# Altium schematic sheet PLC.SchDoc
size A4; SheetNumber: 2; SheetTotal: 2
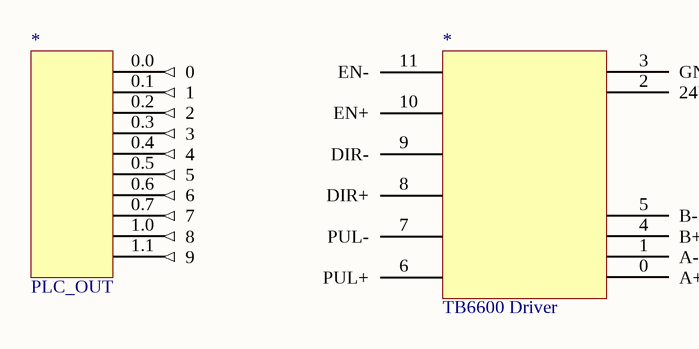
[diagram p0: PLC.SchDoc]

## Parts
(Parts that share a designator on the sheet are numbered #1, #2 ... from top to bottom, then left to right.)
*#1  TB6600 Driver
*#2  PLC_OUT

## Nets

Not connected (* = marked no-connect by the designer): *#1 0(A+) 1(A-) 2(24V) 3(GND) 4(B+) 5(B-) 6(PUL+) 7(PUL-) 8(DIR+) 9(DIR-) 10(EN+) 11(EN-); *#2 0.0(0) 0.1(1) 0.2(2) 0.3(3) 0.4(4) 0.5(5) 0.6(6) 0.7(7) 1.0(8) 1.1(9)